# Altium schematic sheet in_out.SchDoc: Relays and digital input
size A3; Author: Daniele Basile <asterix@develer.com>; Organization: Develer s.r.l.; Address1: via Mugellese 1/A; Address2: 50019 Campi Bisenzio; Address3: Firenze; Address4: ITALY; DocumentNumber: 3; Revision: A; SheetNumber: 3; SheetTotal: 4; Hw_rev: R1
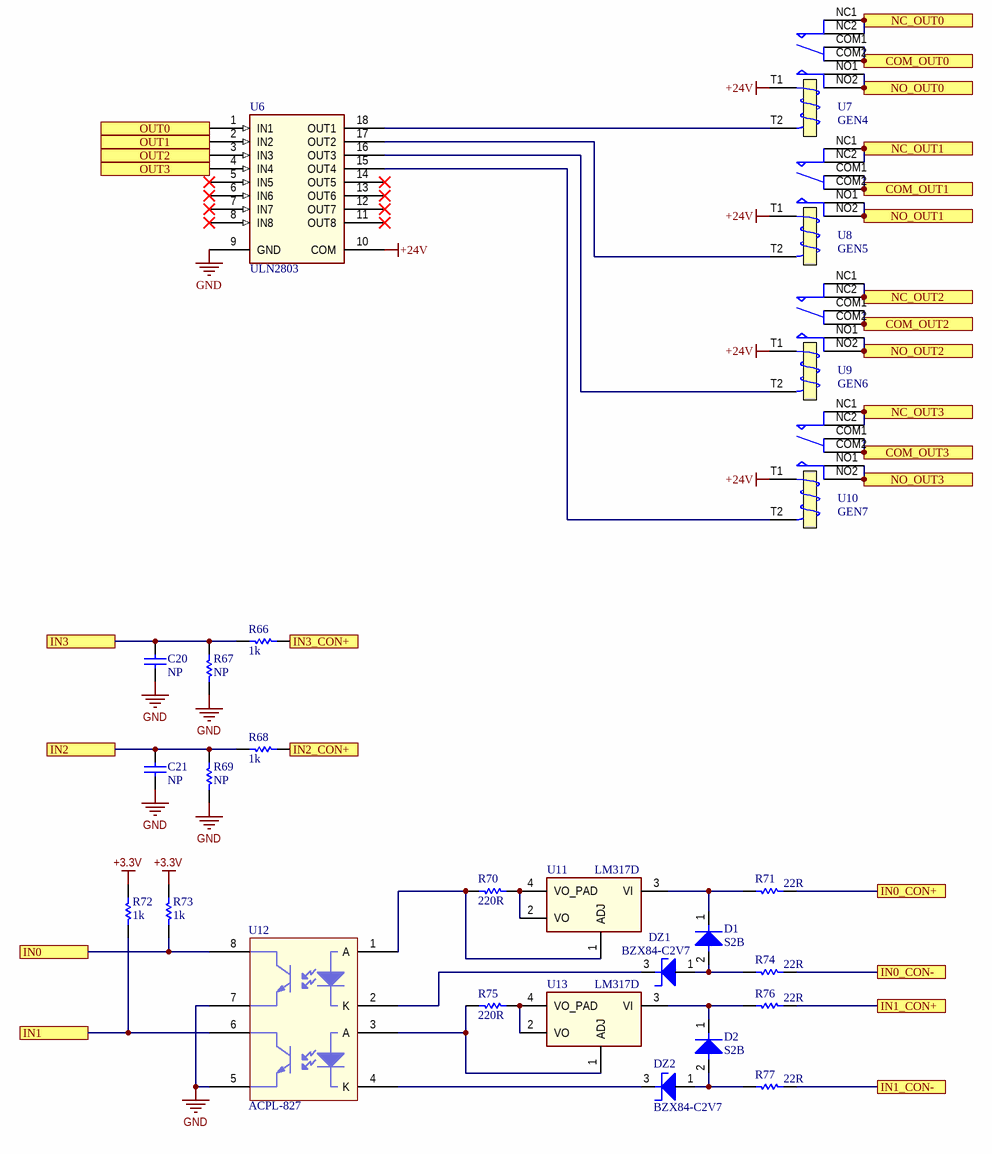
[diagram p0: in_out.SchDoc]

## Parts
C20  NP  [0603_[1608]]
C21  NP  [0603_[1608]]
D1  S2B  [DO214AA_K1-A2_SMB]
D2  S2B  [DO214AA_K1-A2_SMB]
DZ1  BZX84-C2V7  [SOT-23]
DZ2  BZX84-C2V7  [SOT-23]
R66  1k  [0603_[1608]]
R67  NP  [0603_[1608]]
R68  1k  [0603_[1608]]
R69  NP  [0603_[1608]]
R70  220R  [0603_[1608]]
R71  22R  [0603_[1608]]
R72  1k  [0603_[1608]]
R73  1k  [0603_[1608]]
R74  22R  [0603_[1608]]
R75  220R  [0603_[1608]]
R76  22R  [0603_[1608]]
R77  22R  [0603_[1608]]
U6  ULN2803  [SOIC18]
U7  GEN4  [relays_spco_thd_28x12mm_5mm]
U8  GEN5  [relays_spco_thd_28x12mm_5mm]
U9  GEN6  [relays_spco_thd_28x12mm_5mm]
U10  GEN7  [relays_spco_thd_28x12mm_5mm]
U11  LM317D  [SOT-223]
U12  ACPL-827  [SOIC8_OPTO]
U13  LM317D  [SOT-223]

## Ports
COM_OUT0, COM_OUT1, COM_OUT2, COM_OUT3, IN0, IN0_CON+, IN0_CON-, IN1, IN1_CON+, IN1_CON-, IN2, IN2_CON+, IN3, IN3_CON+, NC_OUT0, NC_OUT1, NC_OUT2, NC_OUT3, NO_OUT0, NO_OUT1, NO_OUT2, NO_OUT3, OUT0, OUT1, OUT2, OUT3

## Nets
+3.3V: R72.2 R73.2
+24V: U6.10(COM) U7.T1 U8.T1 U9.T1 U10.T1
GND: C20.1 C21.1 R67.1 R69.1 U6.9(GND) U12.5 U12.7
COM_OUT0: U7.COM1 U7.COM2 ; port COM_OUT0
COM_OUT1: U8.COM1 U8.COM2 ; port COM_OUT1
COM_OUT2: U9.COM1 U9.COM2 ; port COM_OUT2
COM_OUT3: U10.COM1 U10.COM2 ; port COM_OUT3
IN0: R73.1 U12.8 ; port IN0
IN0_CON+: R71.2 ; port IN0_CON+
IN0_CON-: R74.2 ; port IN0_CON-
IN1: R72.1 U12.6 ; port IN1
IN1_CON+: R76.2 ; port IN1_CON+
IN1_CON-: R77.2 ; port IN1_CON-
IN2: C21.2 R68.2 R69.2 ; port IN2
IN2_CON+: R68.1 ; port IN2_CON+
IN3: C20.2 R66.2 R67.2 ; port IN3
IN3_CON+: R66.1 ; port IN3_CON+
NC_OUT0: U7.NC1 U7.NC2 ; port NC_OUT0
NC_OUT1: U8.NC1 U8.NC2 ; port NC_OUT1
NC_OUT2: U9.NC1 U9.NC2 ; port NC_OUT2
NC_OUT3: U10.NC1 U10.NC2 ; port NC_OUT3
NO_OUT0: U7.NO1 U7.NO2 ; port NO_OUT0
NO_OUT1: U8.NO1 U8.NO2 ; port NO_OUT1
NO_OUT2: U9.NO1 U9.NO2 ; port NO_OUT2
NO_OUT3: U10.NO1 U10.NO2 ; port NO_OUT3
OUT0: U6.1(IN1) ; port OUT0
OUT1: U6.2(IN2) ; port OUT1
OUT2: U6.3(IN3) ; port OUT2
OUT3: U6.4(IN4) ; port OUT3
NetD1_1: D1.1(K) R71.1 U11.3(VI)
NetD1_2: D1.2(A) DZ1.1(A) R74.1
NetD2_1: D2.1(K) R76.1 U13.3(VI)
NetD2_2: D2.2(A) DZ2.1(A) R77.1
NetDZ1_3: DZ1.3(K) U12.2(K)
NetDZ2_3: DZ2.3(K) U12.4(K)
NetR70_1: R70.1 U11.1(ADJ) U12.1(A)
NetR70_2: R70.2 U11.2(VO) U11.4(VO_PAD)
NetR75_1: R75.1 U12.3(A) U13.1(ADJ)
NetR75_2: R75.2 U13.2(VO) U13.4(VO_PAD)
NetU6_15: U6.15(OUT4) U10.T2
NetU6_16: U6.16(OUT3) U9.T2
NetU6_17: U6.17(OUT2) U8.T2
NetU6_18: U6.18(OUT1) U7.T2

Not connected (* = marked no-connect by the designer): U6 5(IN5)* 6(IN6)* 7(IN7)* 8(IN8)* 11(OUT8)* 12(OUT7)* 13(OUT6)* 14(OUT5)*

## Notes on the sheet
- Title:
- Status:
- Author:
- License:
- Project:
- -
- Prj Rev:
- Size:
- A3
- File:
- Date:
- Time:
- Sheet
- of

## Library data of the parts
C20 C21 = Cap: Ceramic X7R 50V; Value: 100pF; Published: 8-Jun-2000; LatestRevisionDate: 17-Jul-2002; LatestRevisionNote: Re-released for DXP Platform.; PackageReference: RAD-0.3; Publisher: Altium Limited; PackageDescription: Radial Cap, Thru-Hole; 2 Leads; 0.3 in Pin Spacing
D1 D2 = Diode: S2B Diode
DZ1 DZ2 = ZENER_BZX: Zener 2,7V
R66-R77 = Res1: Resistor; Revision: July-2002: Re-released for DXP Platform.
U6 = ULN2803: BJT Darlinton Array
U7-U10 = Relay SPCO_8pin: Rele NT75CS16DC12V0.415.0 16A 12V
U11 U13 = LM317: 3-Terminal Adjustable Regulator, 3-pin SOT-223; case: THD
U12 = optocoupler 2ch: Optocoupler